# EAGLE schematic STM32F303K8basic (EAGLE 9.6.2)
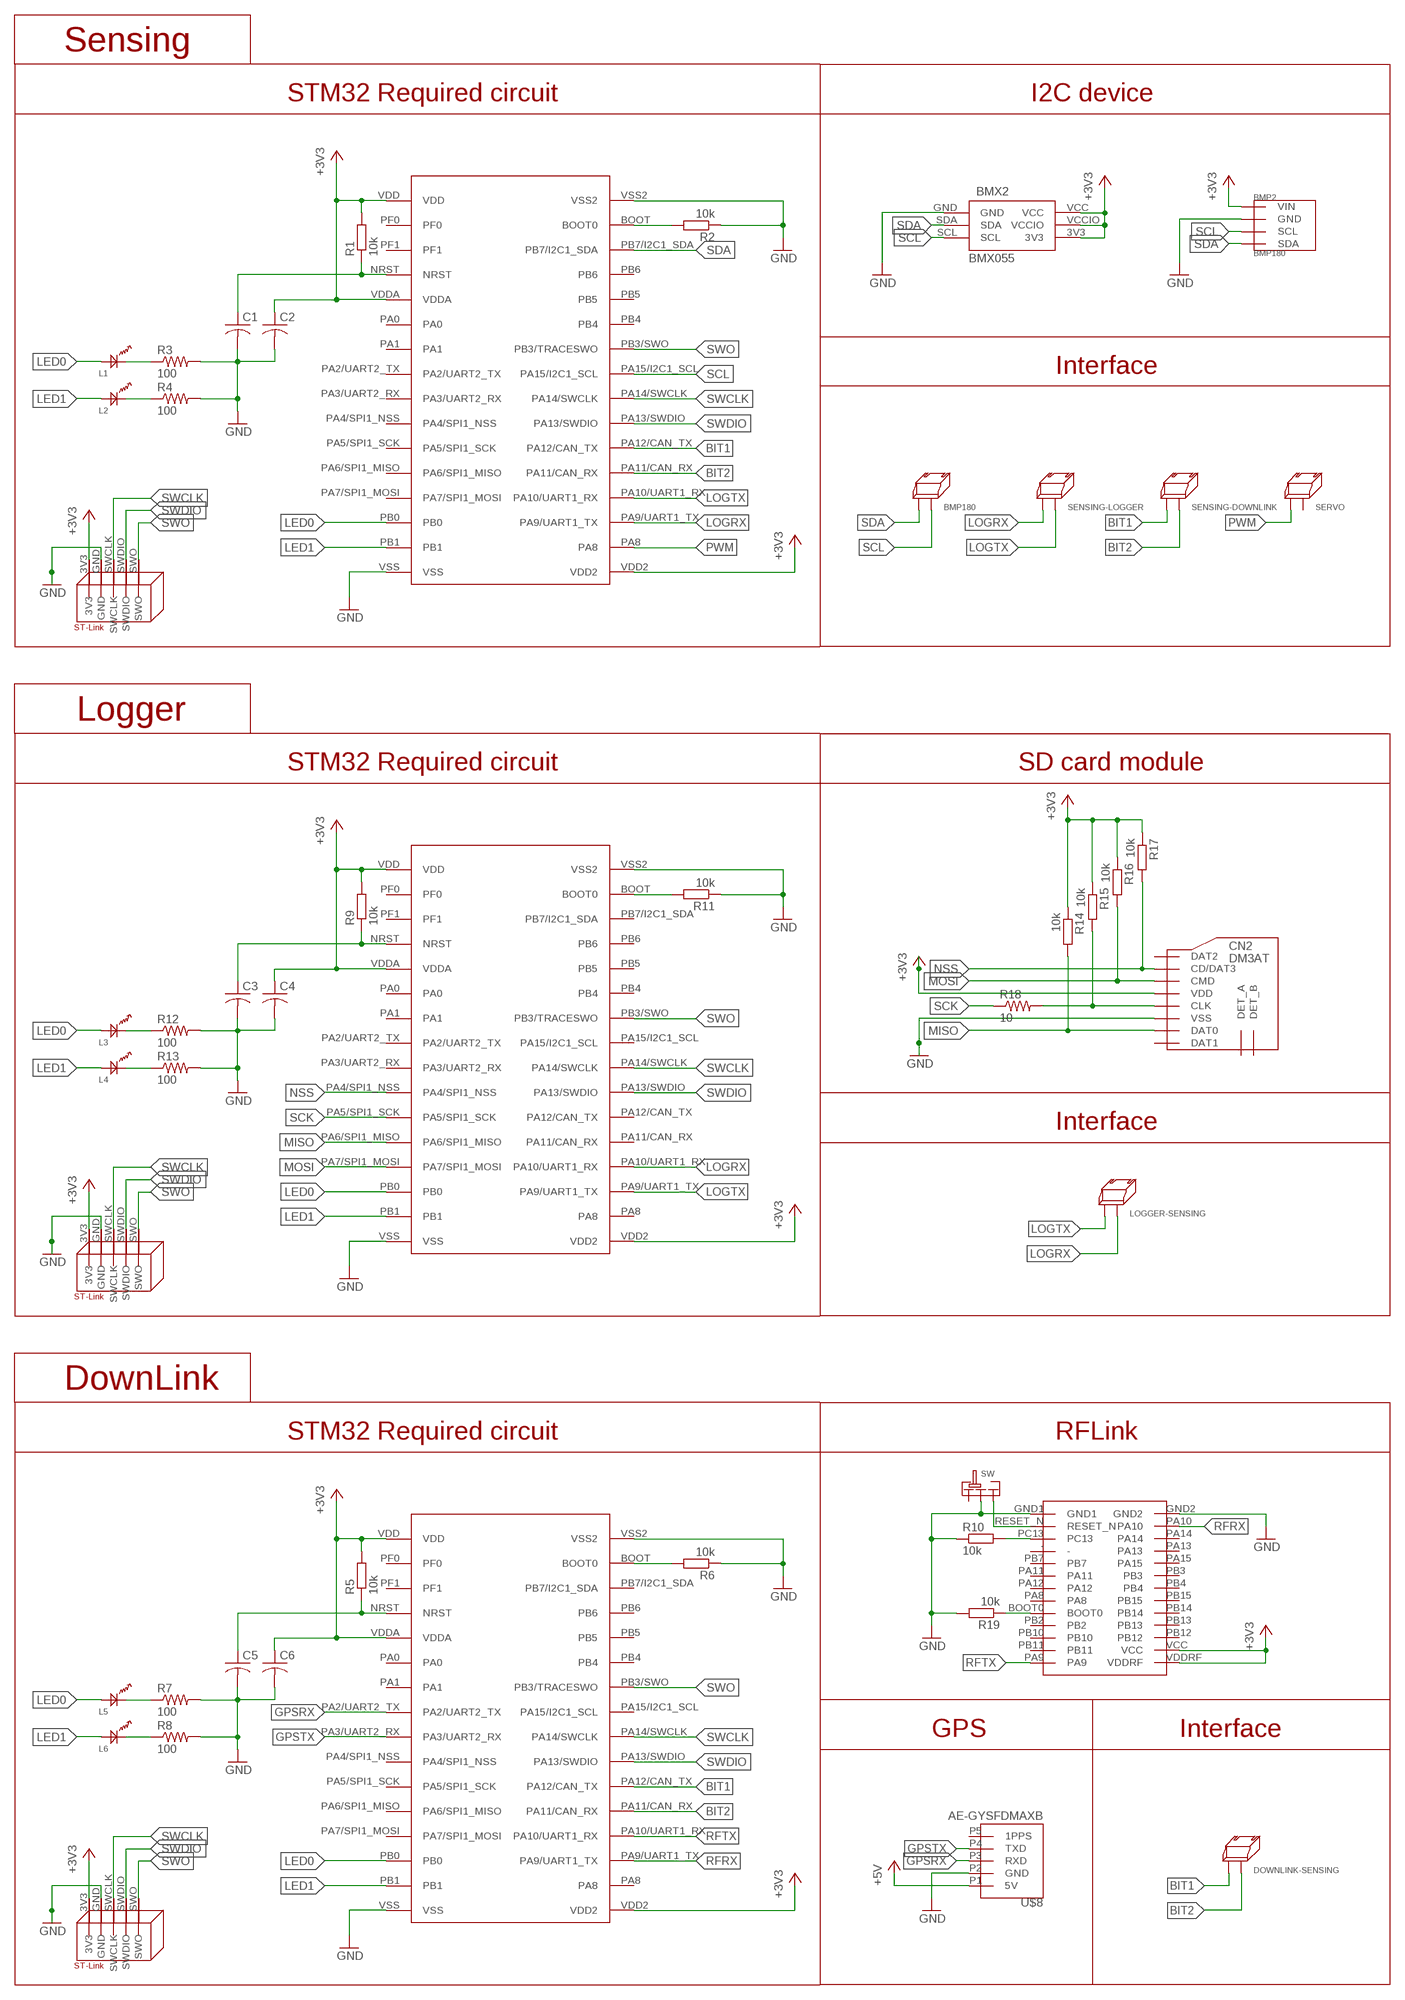
[diagram p0: schematic, sheet 1]

## Parts
BMP2  BMP180  [GY-68]
BMP180  2PIN_SIDE  [2PIN_SIDE]
BMX2  BMX055  [BMX055]
C1  C-USC3216  [C3216]
C2  C-USC3216  [C3216]
C3  C-USC3216  [C3216]
C4  C-USC3216  [C3216]
C5  C-USC3216  [C3216]
C6  C-USC3216  [C3216]
CN2  DM3AT  [DM3AT]
DOWNLINK-SENSING  2PIN_SIDE  [2PIN_SIDE]
L1  OSXX1608C1A  [OSXX1608C1A]
L2  OSXX1608C1A  [OSXX1608C1A]
L3  OSXX1608C1A  [OSXX1608C1A]
L4  OSXX1608C1A  [OSXX1608C1A]
L5  OSXX1608C1A  [OSXX1608C1A]
L6  OSXX1608C1A  [OSXX1608C1A]
LOGGER-SENSING  2PIN_SIDE  [2PIN_SIDE]
R1  10k  R-EU_R0603  [R0603]
R2  10k  R-EU_R0603  [R0603]
R3  100  R-US_R0603  [R0603]
R4  100  R-US_R0603  [R0603]
R5  10k  R-EU_R0603  [R0603]
R6  10k  R-EU_R0603  [R0603]
R7  100  R-US_R0603  [R0603]
R8  100  R-US_R0603  [R0603]
R9  10k  R-EU_R0603  [R0603]
R10  10k  R-EU_R0603  [R0603]
R11  10k  R-EU_R0603  [R0603]
R12  100  R-US_R0603  [R0603]
R13  100  R-US_R0603  [R0603]
R14  10k  R-EU_R0603  [R0603]
R15  10k  R-EU_R0603  [R0603]
R16  10k  R-EU_R0603  [R0603]
R17  10k  R-EU_R0603  [R0603]
R18  10  R-US_R2512  [R2512]
R19  10k  R-EU_R0603  [R0603]
SENSING-DOWNLINK  2PIN_SIDE  [2PIN_SIDE]
SENSING-LOGGER  2PIN_SIDE  [2PIN_SIDE]
SERVO  2PIN_SIDE  [2PIN_SIDE]
SW  SRIDE_SWITCH  [SRIDE_SWITCH]
U$1  STM32F303K8  [STM32F303K8]
U$2  RM-92A  [RM-92A]
U$3  STLINK  [STLINK]
U$4  STM32F303K8  [STM32F303K8]
U$5  STLINK  [STLINK]
U$6  STM32F303K8  [STM32F303K8]
U$7  STLINK  [STLINK]
U$8  AE-GYSFDMAXB  [AE-GYSFDMAXB]

## Nets
+3V3: BMP2.P1(VIN) BMX2.3V3 BMX2.VCC BMX2.VCCIO C2.1 C4.1 C6.1 CN2.VDD R1.2 R5.2 R9.2 R14.1 R15.1 R16.1 R17.1 U$1.VDD U$1.VDD2 U$1.VDDA U$2.VCC U$2.VDDRF U$3.3V3 U$4.VDD U$4.VDD2 U$4.VDDA U$5.3V3 U$6.VDD U$6.VDD2 U$6.VDDA U$7.3V3
+5V: U$8.P1(5V)
BIT1: DOWNLINK-SENSING.P$2 SENSING-DOWNLINK.P$2 U$1.PA12/CAN_TX U$6.PA12/CAN_TX
BIT2: DOWNLINK-SENSING.P$1 SENSING-DOWNLINK.P$1 U$1.PA11/CAN_RX U$6.PA11/CAN_RX
GND: BMP2.P2(GND) BMX2.GND C1.2 C2.2 C3.2 C4.2 C5.2 C6.2 CN2.VSS R2.1 R3.2 R4.2 R6.1 R7.2 R8.2 R10.1 R11.1 R12.2 R13.2 R19.2 SW.LR U$1.VSS U$1.VSS2 U$2.GND1 U$2.GND2 U$3.GND U$4.VSS U$4.VSS2 U$5.GND U$6.VSS U$6.VSS2 U$7.GND U$8.P2(GND)
GPSRX: U$6.PA2/UART2_TX U$8.P3(RXD)
GPSTX: U$6.PA3/UART2_RX U$8.P4(TXD)
LED0: L1.AN L3.AN L5.AN U$1.PB0 U$4.PB0 U$6.PB0
LED1: L2.AN L4.AN L6.AN U$1.PB1 U$4.PB1 U$6.PB1
LOGRX: LOGGER-SENSING.P$1 SENSING-LOGGER.P$2 U$1.PA9/UART1_TX U$4.PA10/UART1_RX
LOGTX: LOGGER-SENSING.P$2 SENSING-LOGGER.P$1 U$1.PA10/UART1_RX U$4.PA9/UART1_TX
MISO: CN2.DAT0 R14.2 U$4.PA6/SPI1_MISO
MOSI: CN2.CMD R16.2 U$4.PA7/SPI1_MOSI
N$1: C1.1 R1.1 U$1.NRST
N$2: R2.2 U$1.BOOT(BOOT0)
N$3: L1.CT R3.1
N$4: L2.CT R4.1
N$5: C3.1 R9.1 U$4.NRST
N$6: R11.2 U$4.BOOT(BOOT0)
N$7: L3.CT R12.1
N$8: L4.CT R13.1
N$9: C5.1 R5.1 U$6.NRST
N$10: R6.2 U$6.BOOT(BOOT0)
N$11: L5.CT R7.1
N$12: L6.CT R8.1
N$13: R19.1 U$2.BOOT0
N$14: R10.2 U$2.PC13
N$15: SW.R U$2.RESET_N
NSS: CN2.CD/DAT3 R17.2 U$4.PA4/SPI1_NSS
PWM: SERVO.P$2 U$1.PA8
RFRX: U$2.PA10 U$6.PA9/UART1_TX
RFTX: U$2.PA9 U$6.PA10/UART1_RX
SCK: CN2.CLK R15.2 R18.1 R18.2 U$4.PA5/SPI1_SCK
SCL: BMP2.P3(SCL) BMP180.P$1 BMX2.SCL U$1.PA15/I2C1_SCL
SDA: BMP2.P4(SDA) BMP180.P$2 BMX2.SDA U$1.PB7/I2C1_SDA
SWCLK: U$1.PA14/SWCLK U$3.SWCLK U$4.PA14/SWCLK U$5.SWCLK U$6.PA14/SWCLK U$7.SWCLK
SWDIO: U$1.PA13/SWDIO U$3.SWDIO U$4.PA13/SWDIO U$5.SWDIO U$6.PA13/SWDIO U$7.SWDIO
SWO: U$1.PB3/SWO(PB3/TRACESWO) U$3.SWO U$4.PB3/SWO(PB3/TRACESWO) U$5.SWO U$6.PB3/SWO(PB3/TRACESWO) U$7.SWO
Unconnected: CN2.DAT1 CN2.DAT2 CN2.DET_A CN2.DET_B SERVO.P$1 SW.L U$1.PA0 U$1.PA1 U$1.PA2/UART2_TX U$1.PA3/UART2_RX U$1.PA4/SPI1_NSS U$1.PA5/SPI1_SCK U$1.PA6/SPI1_MISO U$1.PA7/SPI1_MOSI U$1.PB4 U$1.PB5 U$1.PB6 U$1.PF0 U$1.PF1 U$2.- U$2.PA8 U$2.PA11 U$2.PA12 U$2.PA13 U$2.PA14 U$2.PA15 U$2.PB2 U$2.PB3 U$2.PB4 U$2.PB7 U$2.PB10 U$2.PB11 U$2.PB12 U$2.PB13 U$2.PB14 U$2.PB15 U$4.PA0 U$4.PA1 U$4.PA2/UART2_TX U$4.PA3/UART2_RX U$4.PA8 U$4.PA11/CAN_RX U$4.PA12/CAN_TX U$4.PA15/I2C1_SCL U$4.PB4 U$4.PB5 U$4.PB6 U$4.PB7/I2C1_SDA U$4.PF0 U$4.PF1 U$6.PA0 U$6.PA1 U$6.PA4/SPI1_NSS U$6.PA5/SPI1_SCK U$6.PA6/SPI1_MISO U$6.PA7/SPI1_MOSI U$6.PA8 U$6.PA15/I2C1_SCL U$6.PB4 U$6.PB5 U$6.PB6 U$6.PB7/I2C1_SDA U$6.PF0 U$6.PF1 U$8.P5(1PPS)

## Notes on the sheet
- Sensing
- STM32 Required circuit | I2C device
- Interface
- Logger
- STM32 Required circuit | SD card module
- Interface
- DownLink
- STM32 Required circuit | RFLink
- GPS | Interface

## Library data of the parts
BMP2 = BMP180:BMP180
BMP180 DOWNLINK-SENSING LOGGER-SENSING SENSING-DOWNLINK SENSING-LOGGER SERVO = XR Connector:2PIN_SIDE
BMX2 = BMX055:BMX055
C1-C6 = rcl:C-US: CAPACITOR, American symbol; SPICEPREFIX: C
CN2 = microSD:DM3AT
L1-L6 = Chip LED:OSXX1608C1A
R1 R2 R5 R6 R9-R11 R14-R17 R19 = rcl:R-EU_: RESISTOR, European symbol; SPICEPREFIX: R
R3 R4 R7 R8 R12 R13 R18 = rcl:R-US_: RESISTOR, American symbol; SPICEPREFIX: R
SW = Sride Switch:SRIDE_SWITCH
U$1 U$4 U$6 = STM32F303K8:STM32F303K8
U$2 = RM-92A:RM-92A
U$3 U$5 U$7 = STLink:STLINK
U$8 = AE-GYSFDMAXB:AE-GYSFDMAXB